# Altium schematic sheet MCU.SchDoc
size 420 x 297 mm; SheetNumber: 4; SheetTotal: 4
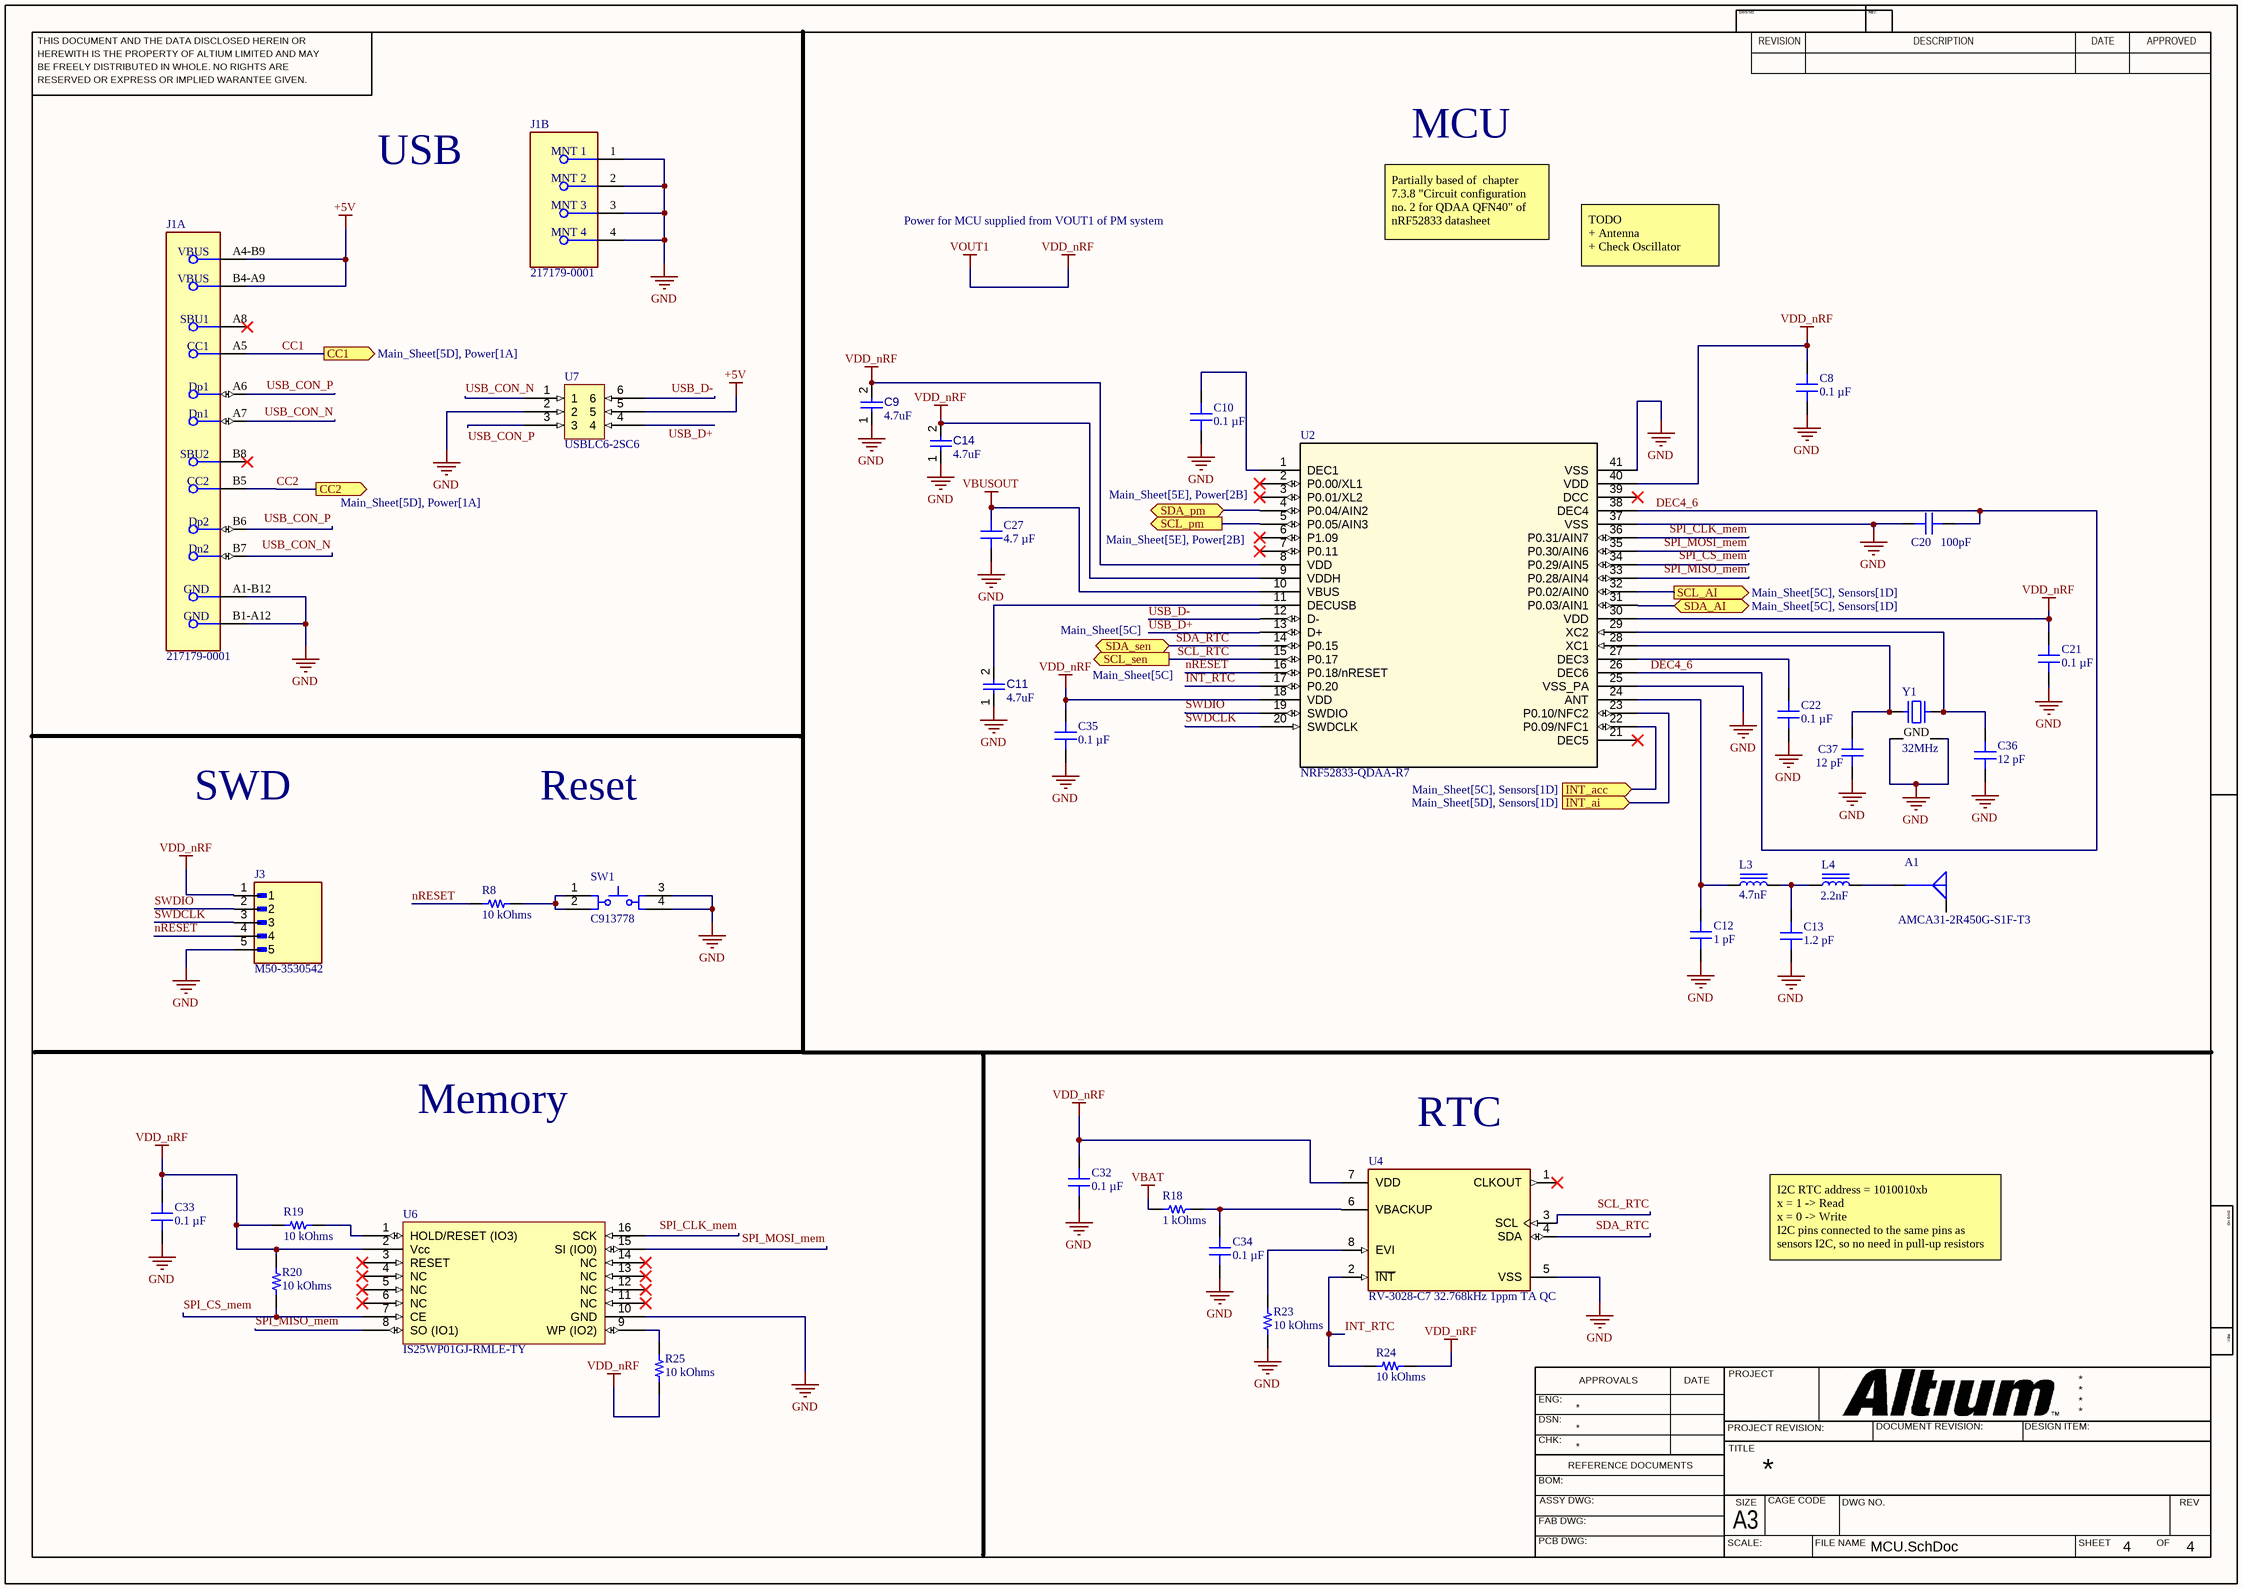
[diagram p0: MCU.SchDoc]

## Parts
A1  AMCA31-2R450G-S1F-T3  [ABRACON AMCA31-2R450G-S1F-T3]
C8  0.1 µF  [CAP 0402_1005]
C9  value 4.7uF  [CAPC0603(1608)100_L]  (hidden comment: Capacitor 1µF +/-40% 50V 0603)
C10  0.1 µF  [CAP 0402_1005]
C11  value 4.7uF  [CAPC0603(1608)100_L]  (hidden comment: Capacitor 1µF +/-40% 50V 0603)
C12  1 pF  [CAP 0201_0603]
C13  1.2 pF  [MURATA GJM033 0201_0603]
C14  value 4.7uF  [CAPC0603(1608)100_L]  (hidden comment: Capacitor 1µF +/-40% 50V 0603)
C20  100pF  [CAP 0402_1005]
C21  0.1 µF  [CAP 0402_1005]
C22  0.1 µF  [CAP 0402_1005]
C27  4.7 µF  [MURATA GRM188 0603_1608]
C32  0.1 µF  [CAP 0402_1005]
C33  0.1 µF  [CAP 0402_1005]
C34  0.1 µF  [CAP 0402_1005]
C35  0.1 µF  [CAP 0402_1005]
C36  12 pF  [CAP 0402_1005]
C37  12 pF  [CAP 0402_1005]
J1  217179-0001  [FP-2171790001-MFG]  (parts A,B of 2)
J3  M50-3530542  [HARWIN_M50-3530542]
L3  4.7nF  [Murata LQW15 0402]
L4  2.2nF  [Murata LQW15 0402]
R8  10 kOhms  [RES 0402_1005]
R18  1 kOhms  [YAGEO RES 0402_1005]
R19  10 kOhms  [RES 0402_1005]
R20  10 kOhms  [RES 0402_1005]
R23  10 kOhms  [RES 0402_1005]
R24  10 kOhms  [RES 0402_1005]
R25  10 kOhms  [RES 0402_1005]
SW1  C913778  [ESWI-TL3342F160QG_V]
U2  NRF52833-QDAA-R7  [QFN40_5X5_DQ_NOR]
U4  RV-3028-C7 32.768kHz 1ppm TA QC  [FP-RV-3028-C7_32_768kHz_1-MFG]
U6  IS25WP01GJ-RMLE-TY  [SOIC127P1030X265-16N]
U7  USBLC6-2SC6  [STM-SOT23-6L_V]
Y1  32MHz  [ABRACON ABM10]

## Ports
CC1 (out, see Main_Sheet[5D], Power[1A]), CC2 (out, see Main_Sheet[5D], Power[1A]), INT_acc (in, see Main_Sheet[5C], Sensors[1D]), INT_ai (in, see Main_Sheet[5D], Sensors[1D]), SCL_AI (out, see Main_Sheet[5C], Sensors[1D]), SCL_pm (out, see Main_Sheet[5E], Power[2B]), SCL_sen (out, see Main_Sheet[5C]), SDA_AI (bidir, see Main_Sheet[5C], Sensors[1D]), SDA_pm (bidir, see Main_Sheet[5E], Power[2B]), SDA_sen (bidir, see Main_Sheet[5C])

## Nets
+5V: J1.A4-B9(VBUS) J1.B4-A9(VBUS) U7.5
GND: C8.1 C9.1 C10.1 C11.1 C12.1 C13.1 C14.1 C20.1 C21.1 C22.1 C27.1 C32.1 C33.1 C34.1 C35.1 C36.1 C37.1 J1.1(MNT_1) J1.2(MNT_2) J1.3(MNT_3) J1.4(MNT_4) J1.A1-B12(GND) J1.B1-A12(GND) J3.5 R23.1 SW1.3 SW1.4 U2.25(VSS_PA) U2.37(VSS) U2.41(VSS) U4.5(VSS) U6.10(GND) U7.2 Y1.2(GND) Y1.4(GND)
VBAT: R18.1
VBUSOUT: C27.2 U2.10(VBUS)
VDD_nRF: C8.2 C9.2 C14.2 C21.2 C32.2 C33.2 C35.2 J3.1 R19.2 R20.2 R24.1 R25.1 U2.8(VDD) U2.9(VDDH) U2.18(VDD) U2.30(VDD) U2.40(VDD) U4.7(VDD) U6.2(Vcc)  [also labelled VOUT1]
CC1: J1.A5(CC1) ; port CC1
CC2: J1.B5(CC2) ; port CC2
DEC4_6: C20.2 U2.26(DEC6) U2.38(DEC4)
INT_acc: U2.22(P0.09/NFC1) ; port INT_acc
INT_ai: U2.23(P0.10/NFC2) ; port INT_ai
INT_RTC: R24.2 U2.17(P0.20) U4.2(~{INT})
nRESET: J3.4 R8.2 U2.16(P0.18/nRESET)
SCL_AI: U2.32(P0.02/AIN0) ; port SCL_AI
SCL_pm: U2.5(P0.05/AIN3) ; port SCL_pm
SCL_RTC: U2.15(P0.17) U4.3(SCL) ; port SCL_sen
SDA_AI: U2.31(P0.03/AIN1) ; port SDA_AI
SDA_pm: U2.4(P0.04/AIN2) ; port SDA_pm
SDA_RTC: U2.14(P0.15) U4.4(SDA) ; port SDA_sen
SPI_CLK_mem: U2.36(P0.31/AIN7) U6.16(SCK)
SPI_CS_mem: R20.1 U2.34(P0.29/AIN5) U6.7(CE)
SPI_MISO_mem: U2.33(P0.28/AIN4) U6.8(SO_(IO1))
SPI_MOSI_mem: U2.35(P0.30/AIN6) U6.15(SI_(IO0))
SWDCLK: J3.3 U2.20(SWDCLK)
SWDIO: J3.2 U2.19(SWDIO)
USB_CON_N: J1.A7(Dn1) J1.B7(Dn2) U7.1
USB_CON_P: J1.A6(Dp1) J1.B6(Dp2) U7.3
USB_D+: U2.13(D+) U7.4
USB_D-: U2.12(D-) U7.6
NetA1_S: A1.S L4.2
NetC10_2: C10.2 U2.1(DEC1)
NetC11_2: C11.2 U2.11(DECUSB)
NetC12_2: C12.2 L3.1 U2.24(ANT)
NetC13_2: C13.2 L3.2 L4.1
NetC22_2: C22.2 U2.27(DEC3)
NetC34_2: C34.2 R18.2 U4.6(VBACKUP)
NetC36_2: C36.2 U2.29(XC2) Y1.3
NetC37_2: C37.2 U2.28(XC1) Y1.1
NetR8_1: R8.1 SW1.1 SW1.2
NetR19_1: R19.1 U6.1(HOLD/RESET_(IO3))
NetR23_2: R23.2 U4.8(EVI)
NetR25_2: R25.2 U6.9(WP_(IO2))

Not connected (* = marked no-connect by the designer): A1 G; J1 A8(SBU1)* B8(SBU2)*; U2 2(P0.00/XL1)* 3(P0.01/XL2)* 6(P1.09)* 7(P0.11)* 21(DEC5)* 39(DCC)*; U4 1(CLKOUT)*; U6 3(RESET)* 4(NC)* 5(NC)* 6(NC)* 11(NC)* 12(NC)* 13(NC)* 14(NC)*

## Notes on the sheet
- USB
- MCU
- Power for MCU supplied from VOUT1 of PM system
- Partially based of  chapter 7.3.8 "Circuit configuration no. 2 for QDAA QFN40" of nRF52833 datasheet
- TODO
  + Antenna
  + Check Oscillator
- SWD
- Reset
- Memory
- (near U4) RTC
- I2C RTC address = 1010010xb
  x = 1 -> Read
  x = 0 -> Write
  I2C pins connected to the same pins as sensors I2C, so no need in pull-up resistors
- THIS DOCUMENT AND THE DATA DISCLOSED HEREIN OR
- HEREWITH IS THE PROPERTY OF ALTIUM LIMITED AND MAY
- DWG NO:
- REVISION
- REV:
- DESCRIPTION
- DATE
- APPROVED
- BE FREELY DISTRIBUTED IN WHOLE. NO RIGHTS ARE
- RESERVED OR EXPRESS OR IMPLIED WARANTEE GIVEN.
- ENG:
- APPROVALS
- PROJECT
- DSN:
- CHK:
- REFERENCE DOCUMENTS
- PROJECT REVISION:
- TITLE
- DOCUMENT REVISION:
- DESIGN ITEM:
- BOM:
- FAB DWG:
- PCB DWG:
- ASSY DWG:
- SCALE:
- A3
- SIZE
- CAGE CODE
- FILE NAME
- DWG NO.
- SHEET
- OF
- REV

## Library data of the parts
A1 = AMCA31-2R450G-S1F-T3: RF ANT 2.4GHZ CHIP SOLDER SMD; Manufacturer: Abracon LLC; Frequency Group: UHF (2GHz ~ 3GHz); Frequency Range: 2.405GHz ~ 2.495GHz; Gain: 0.5dBi; Number of Bands: 1; Power - Max: 3 W; RF Family/Standard: Bluetooth, WiFi; VSWR: 2; Part Number: AMCA31-2R450G-S1F-T3; Antenna Type: Chip; Applications: Bluetooth, Wi-Fi, WLAN; ComponentLink1Description: Datasheet; ComponentLink1URL: https://abracon.com/chip-antenna/AMCA31-2R450G-S1F-T.pdf; ComponentLink2Description: DigiKey Link; ComponentLink2URL: https://www.digikey.com/en/products/detail/abracon-llc/AMCA31-2R450G-S1F-T3/4494340; Frequency (Center/Band): 2.4GHz; Height (Max): 0.047" (1.20mm); LastUpdated: 7/25/2025 4:53:03 PM; Lifecycle Status: Active; Minimum Order: 1; Mounting Type: Surface Mount; Packaging: TapeAndReel; Part Status: Active; Price: 0.15; Series: AMCA; Supplier 1: DigiKey; Supplier Part Number 1: 535-14095-1-ND; Termination: Solder
C8 C10 C21 C35 = CL05B104KP5VPNC: CAP CER 100NF 10V X7R 0402; manufacturer: Samsung Electro-Mechanics; Temperature Coefficient: X7S; Tolerance: ±10%; Part Number: CL05B104KP5VPNC; Capacitance: 0.1 µF; Applications: Automotive; componentlink1description: Datasheet; componentlink1url: https://mm.digikey.com/Volume0/opasdata/d220001/medias/docus/5458/CL05B104KP5VPNC_Spec.pdf; componentlink2description: DigiKey Link; componentlink2url: https://www.digikey.com/en/products/detail/samsung-electro-mechanics/CL05B104KP5VPNC/20498482; Device Package: 0402 (1005 Metric); lastupdated: 2/9/2024 8:03:17 PM; Lifecycle Status: Active; Minimum Order: 1; Mounting Type: Surface Mount, MLCC; Operating Temperature: -55°C ~ 125°C; Package / Case: 0402 (1005 Metric); packaging: TapeAndReel; partid: 56690; price: 0.01; Ratings: AEC-Q200; series: CL; Size / Dimension: 0.039" L x 0.020" W (1.00mm x 0.50mm); Supplier 1: DigiKey; Supplier Part Number 1: 1276-CL05B104KP5VPNCCT-ND; Thickness (Max): 0.022" (0.55mm); value: 0.1 µF; Voltage - Rated: 10V
C9 C11 C14 = CMP-001-00078-4: Chip Capacitor, 1µF +/-40%, 50V, 0603, Thickness 1 mm; Tolerance: 10%; Case/Package: 0603; Pins: 2; Max Operating Temperature: 85°C; Voltage Rating: 50V; Mounting Technology: SMT; Min Operating Temperature: -55°C
C12 = CL03C010BA3GNNC: CAP CER 1PF 25V C0G/NP0 0201; manufacturer: Samsung Electro-Mechanics; Temperature Coefficient: C0G, NP0; Tolerance: ±5%; Part Number: CL03C010BA3GNNC; Capacitance: 1 pF; Applications: General Purpose; componentlink1description: Datasheet; componentlink1url: http://www.samsungsem.com/kr/support/product-search/mlcc/CL03C010BA3GNNC.jsp; componentlink2description: DigiKey Link; componentlink2url: https://www.digikey.com/en/products/detail/samsung-electro-mechanics/CL03C010BA3GNNC/3887019; Device Package: 0201 (0603 Metric); lastupdated: 6/4/2024 7:01:06 PM; Lifecycle Status: Active; Minimum Order: 1; Mounting Type: Surface Mount, MLCC; Operating Temperature: -55°C ~ 125°C; Package / Case: 0201 (0603 Metric); packaging: TapeAndReel; partid: 1289; Part Status: Active; price: 0.01; series: CL; Size / Dimension: 0.024" L x 0.012" W (0.60mm x 0.30mm); Supplier 1: DigiKey; Supplier Part Number 1: 1276-1361-1-ND; Thickness (Max): 0.013" (0.33mm); value: 1 pF; Voltage - Rated: 25V
C13 = GJM0335C1E1R2BB01D: CAP CER 1.2PF 25V C0G/NP0 0201; manufacturer: Murata Electronics; Temperature Coefficient: C0G, NP0; Tolerance: ±5%; Part Number: GJM0335C1E1R2BB01D; Capacitance: 1.2 pF; Applications: RF, Microwave, High Frequency; componentlink1description: Datasheet; componentlink1url: https://search.murata.co.jp/Ceramy/image/img/A01X/G101/ENG/GJM0335C1E1R2BB01-01.pdf; componentlink2description: DigiKey Link; componentlink2url: https://www.digikey.com/en/products/detail/murata-electronics/GJM0335C1E1R2BB01D/2592512; Device Package: 0201 (0603 Metric); Features: High Q, Low Loss; lastupdated: 7/20/2024 12:14:17 AM; Lifecycle Status: Active; Minimum Order: 1; Mounting Type: Surface Mount; Operating Temperature: -55°C ~ 125°C; Package / Case: 0201 (0603 Metric); packaging: TapeAndReel; partid: 205; Part Status: Active; price: 0.01; series: GJM; Size / Dimension: 0.024" L x 0.012" W (0.60mm x 0.30mm); Supplier 1: DigiKey; Supplier Part Number 1: 490-11173-1-ND; Thickness (Max): 0.013" (0.33mm); value: 1.2 pF; Voltage - Rated: 25V
C20 = 04023A101FAT2A: CAP CER 100PF 25V NP0 0402; manufacturer: AVX Corporation; Temperature Coefficient: C0G, NP0; Tolerance: ±1%; Part Number: 04023A101FAT2A; Capacitance: 100pF; Applications: General Purpose; componentlink1description: Datasheet; componentlink1url: http://datasheets.avx.com/C0GNP0-Dielectric.pdf; componentlink2description: DigiKey Link; componentlink2url: http://digikey.com/product-detail/en/avx-corporation/04023A101FAT2A/478-12607-1-ND/9949145; Device Package: 0402 (1005 Metric); lastupdated: 2/8/2022 12:26:58 PM; Lifecycle Status: Active; Minimum Order: 1; Mounting Type: Surface Mount, MLCC; Operating Temperature: -55°C ~ 125°C; Package / Case: 0402 (1005 Metric); packaging: TapeAndReel; partid: 1996; Part Status: Active; price: 0.11; series: -; Size / Dimension: 0.039" L x 0.020" W (1.00mm x 0.50mm); Supplier 1: DigiKey; Supplier Part Number 1: 478-12607-1-ND; Thickness (Max): 0.022" (0.56mm); value: 100pF; Voltage - Rated: 25V
C22 C32-C34 = CL05B104KP5VPNC: CAP CER 100NF 10V X7R 0402; manufacturer: Samsung Electro-Mechanics; Tolerance: ±10%; Part Number: CL05B104KP5VPNC; Capacitance: 0.1 µF; Applications: Automotive; componentlink1description: Datasheet; componentlink1url: https://mm.digikey.com/Volume0/opasdata/d220001/medias/docus/5458/CL05B104KP5VPNC_Spec.pdf; componentlink2description: DigiKey Link; componentlink2url: https://www.digikey.com/en/products/detail/samsung-electro-mechanics/CL05B104KP5VPNC/20498482; Device Package: 0402 (1005 Metric); lastupdated: 2/9/2024 8:03:17 PM; Lifecycle Status: Active; Minimum Order: 1; Mounting Type: Surface Mount, MLCC; Operating Temperature: -55°C ~ 125°C; Package / Case: 0402 (1005 Metric); packaging: TapeAndReel; partid: 56690; price: 0.01; Ratings: AEC-Q200; series: CL; Size / Dimension: 0.039" L x 0.020" W (1.00mm x 0.50mm); Supplier 1: DigiKey; Supplier Part Number 1: 1276-CL05B104KP5VPNCCT-ND; Temperature Coefficient: X7R; Thickness (Max): 0.022" (0.55mm); value: 0.1 µF; Voltage - Rated: 10V
C27 = GRM188C71A475KE11D: CAP CER 4.7UF 10V X7S 0603; manufacturer: Murata Electronics; Tolerance: ±10%; Part Number: GRM188C71A475KE11D; Capacitance: 4.7 µF; Applications: General Purpose; componentlink1description: Datasheet; componentlink1url: https://search.murata.co.jp/Ceramy/image/img/A01X/G101/ENG/GRM188C71A475KE11-01.pdf; componentlink2description: DigiKey Link; componentlink2url: https://www.digikey.com/en/products/detail/murata-electronics/GRM188C71A475KE11D/4905309; Device Package: 0603 (1608 Metric); lastupdated: 7/20/2024 12:23:22 AM; Lifecycle Status: Active; Minimum Order: 1; Mounting Type: Surface Mount, MLCC; Operating Temperature: -55°C ~ 125°C; Package / Case: 0603 (1608 Metric); packaging: TapeAndReel; partid: 2397; Part Status: Active; price: 0.03; series: GRM; Size / Dimension: 0.063" L x 0.031" W (1.60mm x 0.80mm); Supplier 1: DigiKey; Supplier Part Number 1: 490-11992-1-ND; Temperature Coefficient: X7S; Thickness (Max): 0.037" (0.95mm); value: 4.7 µF; Voltage - Rated: 10V
C36 C37 = CBR04C120F5GAC: CAP CER 12PF 50V C0G/NP0 0402; manufacturer: KEMET; Temperature Coefficient: C0G, NP0; Tolerance: ±1%; Part Number: CBR04C120F5GAC; Capacitance: 12 pF; Applications: RF, Microwave, High Frequency; componentlink1description: Datasheet; componentlink1url: https://api.kemet.com/component-edge/download/datasheet/CBR04C120F5GAC.pdf; componentlink2description: DigiKey Link; componentlink2url: https://www.digikey.com/en/products/detail/kemet/CBR04C120F5GAC/3479654; Device Package: 0402 (1005 Metric); Features: High Q, Low Loss, Ultra Low ESR; lastupdated: 2/9/2024 8:04:38 PM; Lifecycle Status: Active; Minimum Order: 1; Mounting Type: Surface Mount, MLCC; Operating Temperature: -55°C ~ 125°C; Package / Case: 0402 (1005 Metric); packaging: TapeAndReel; partid: 1750; Part Status: Active; price: 0.06; series: CBR-SMD RF C0G; Size / Dimension: 0.039" L x 0.020" W (1.00mm x 0.50mm); Supplier 1: DigiKey; Supplier Part Number 1: 399-8815-1-ND; Thickness (Max): 0.022" (0.55mm); value: 12 pF; Voltage - Rated: 50V
J1 = CMP-04767-000028-2: CONN RCP USB2.0 TYP C 24P SMD RA; NexarPartId: 117190526; Gender: Receptacle; Number of Contacts: 16; Current Rating: 1.25A; Voltage Rating: 30V; Min Operating Temperature: -40°C; USB Standard: USB 2.0; Height: 3.36mm; Contact Material: Gold, Nickel; Max Operating Temperature: 85°C
J3 = CMP-002-00071-1: 1.27mm (0.05) Pitch SIL Vertical Throughboard Pin Header, selective gold + tin, 5 contacts; MF: Harwin; Value: *; Component Type: Standard; Pins: 5; Design Item ID: M50-3530542; Case/Package: None; Source: M50-3530542.SchLib; SnapEDA_Link: https://www.snapeda.com/parts/M50-3530542/Harwin/view-part/?ref=snap; MP: M50-3530542; Check_prices: https://www.snapeda.com/parts/M50-3530542/Harwin/view-part/?ref=eda
L3 L4 = LQW15CN2R2M10D: FIXED IND 2.2UH 170MA 1.8OHM SMD; Manufacturer: Murata Electronics; DC Resistance (DCR): 1.8Ohm Max; Frequency - Self Resonant: 100MHz; Inductance: 2.2 µH; Inductance Frequency - Test: 100 MHz; Material - Core: Ferrite; Shielding: Unshielded; Tolerance: ±5%; Type: Drum Core, Wirewound; Value: 2.2 µH; Part Number: LQW15CN2R2M10D; ComponentLink1Description: Datasheet; ComponentLink1URL: https://search.murata.co.jp/Ceramy/image/img/P02/JELF243A-0096.pdf; ComponentLink2Description: DigiKey Link; ComponentLink2URL: https://www.digikey.com/en/products/detail/murata-electronics/LQW15CN2R2M10D/6799054; Current Rating (Amps): 170 mA; Device Package: 0402 (1005 Metric); Height - Seated (Max): 0.024" (0.60mm); LastUpdated: 7/19/2024 11:52:51 PM; Lifecycle Status: Active; Minimum Order: 1; Mounting Type: Surface Mount; Operating Temperature: -55°C ~ 125°C; Package / Case: 0402 (1005 Metric); Packaging: TapeAndReel; PartId: 420; Part Status: Active; Price: 0.17; Series: LQW15; Size / Dimension: 0.039" L x 0.024" W (1.00mm x 0.60mm); Supplier 1: DigiKey; Supplier Part Number 1: 490-15629-1-ND
R8 R19 R20 R23-R25 = RP73PF1E10KBTD: RES 10K OHM 0.1% 1/10W 0402; Manufacturer: TE Connectivity Passive Product; Power (Watts): 0.1W, 1/10W; Temperature Coefficient: ±25ppm/°C; Tolerance: ±1%; Part Number: RP73PF1E10KBTD; Value: 10 kOhms; ComponentLink1Description: Datasheet; ComponentLink1URL: https://www.te.com/commerce/DocumentDelivery/DDEController?Action=srchrtrv&DocNm=1773272&DocType=DS&DocLang=English; ComponentLink2Description: DigiKey Link; ComponentLink2URL: https://www.digikey.com/en/products/detail/te-connectivity-passive-product/RP73PF1E10KBTD/8260957; Composition: Thin Film; Device Package: 0402 (1005 Metric); Height - Seated (Max): 0.014" (0.35mm); LastUpdated: 2/9/2024 8:30:24 PM; Lifecycle Status: Active; Minimum Order: 1; Number of Terminations: 2; Operating Temperature: -55°C ~ 155°C; Package / Case: 0402 (1005 Metric); Packaging: TapeAndReel; PartId: 2434; Part Status: Active; Price: 0.08; Resistance: 10 kOhms; Series: RP73, Holsworthy; Size / Dimension: 0.039" L x 0.020" W (1.00mm x 0.50mm); Supplier 1: DigiKey; Supplier Part Number 1: A127415CT-ND; Supplier Device Package: 0402
R18 = AC0402JR-071KL: RES SMD 1K OHM 5% 1/16W 0402; Manufacturer: Yageo; Power (Watts): 0.063W, 1/16W; Temperature Coefficient: ±100ppm/°C; Part Number: AC0402JR-071KL; Value: 1 kOhms; ComponentLink1Description: Datasheet; ComponentLink1URL: https://www.yageo.com/upload/media/product/productsearch/datasheet/rchip/PYu-AC_51_RoHS_L_7.pdf; ComponentLink2Description: DigiKey Link; ComponentLink2URL: https://www.digikey.com/en/products/detail/yageo/AC0402JR-071KL/5895603; Composition: Thick Film; Device Package: 0402 (1005 Metric); Features: Automotive AEC-Q200, Moisture Resistant; Height - Seated (Max): 0.015" (0.37mm); LastUpdated: 8/31/2025 3:04:17 PM; Lifecycle Status: Active; Minimum Order: 1; Number of Terminations: 2; Operating Temperature: -55°C ~ 155°C; Package / Case: 0402 (1005 Metric); Packaging: CutTape; PartId: 3403; Part Status: Active; Price: 0.01; Ratings: AEC-Q200; Resistance: 1 kOhms; Series: AC; Size / Dimension: 0.039" L x 0.020" W (1.00mm x 0.50mm); Supplier 1: DigiKey; Supplier Part Number 1: YAG3525CT-ND; Supplier Device Package: 0402; Tolerance: ±5%
SW1 = CMP-011-00008-2: Tactile Switch, SPST-NO, 50 mA, 12 V, 4-Pin SMD, RoHS, Tape and Reel; Manufacturer: E-Switch; Operating Force: 1.6N; Current Rating: 50mA; Throw Configuration: SPST; Max Voltage Rating (DC): 12V; Datasheet URL: http://spec_sheets.e-switch.com/specs/P010632.pdf; Manufacturer URL: http://www.e-switch.ch/en/; Mounting Technology: SM; Case/Package: TL3342F160QG; Package Quantity: 3000; Contact Material: Silver; Package Description: 4-Pin Surface Mount Device, Body 5 x 5 mm, Pitch 6.3 mm; Package Reference: TL3342F160QG; Datasheet Version: Rev. I, 12/2010; Voltage Rating (DC): 12V; Contact Plating: Silver; RoHS Compliant: True; Packaging: TapeandReel
U2 = CMP-003-000000-1: Description; Manufacturer_Name: Nordic Semiconductor; Copyright: Copyright (C) 2025 Ultra Librarian. All rights reserved.; Type: Type; Source: NRF52833-QDAA-R7.SchLib; Manufacturer_Part_Number: NRF52833-QDAA-R7; RefDes: RefDes; Design Item ID: NRF52833-QDAA-R7
U4 = CMP-226158-000001-1: Real Time Clock Serial 2byte Clock/Calendar/Alarm/Timer/Battery Backup 8-Pin CSMD T/R; Manufacturer: Micro Crystal; Memory Size: 2Bytes; Number Of Outputs: 1; Nominal Supply Current: 0.04uA; Interface: I2C; Max Supply Voltage: 5.5V; Min Supply Voltage: 1.1V; Package: RV-3028-C7 32.768kHz 1ppm TA QC; Lead Free: Yes; RoHS: TRUE; Device Class L1: Integrated Circuits (ICs); Temperature: -40°C to +85°C; ComponentLink2Description: Datasheet; Height: 0.8mm; Octopart: https://octopart.com/rv-3028-c7+32.768khz+1ppm+ta+qc-micro+crystal-98880451; ComponentLink2URL: https://www.microcrystal.com/fileadmin/Media/Products/RTC/Datasheet/RV-3028-C7.pdf; Device Class L2: Clock and Timing; Temperature Range Low: -40°C; Temperature Range High: +85°C; Automotive: No; Device Class L3: Real Time Clocks; Manufacturer Part Number: RV-3028-C7 32.768kHz 1ppm TA QC; Frequency: 32.768kHz; Ambient Temperature Range High: +85°C; Ambient Temperature Range Low: -40°C; Category: IC; Mouser Description: RV-3028-C7 32.768KHZ 1PPM Ta Qc
U6 = CMP-019-00050-1: Flash Memory, Serial NOR, 1 Gbit, 128M x 8bit, QPI, SPI, SOIC, 16 Pins
U7 = CMP-015-00011-1: 5A 17V 6V Unidirectional 5.25V SOT-23-6 ESD and Surge Protection (TVS/ESD) ROHS; Case/Package: SOT-23; Pins: 6; Max Operating Temperature: 125°C; Min Operating Temperature: -40°C; Mounting Technology: Surface Mount
Y1 = ABM10-32.000MHZ-8-7-A15-T: CRYSTAL 32.0000MHZ 8PF SMD; Manufacturer: Abracon LLC; ESR (Equivalent Series Resistance): 70 Ohms; Frequency Stability: ±15ppm; Operating Mode: Fundamental; Part Number: ABM10-32.000MHZ-8-7-A15-T; ComponentLink1Description: Datasheet; ComponentLink1URL: https://abracon.com/Resonators/ABM10.pdf; ComponentLink2Description: DigiKey Link; ComponentLink2URL: http://digikey.com/product-detail/en/abracon-llc/ABM10-32.000MHZ-8-7-A15-T/535-9625-1-ND/1237092; Device Package: 4-SMD, No Lead; Frequency: 32MHz; Frequency Tolerance: ±15ppm; Height - Seated (Max): 0.028" (0.70mm); LastUpdated: 3/19/2020 10:27:46 PM; Lifecycle Status: Active; Load Capacitance: 8pF; Minimum Order: 1; Mounting Type: Surface Mount; Operating Temperature: -10°C ~ 60°C; Package / Case: 4-SMD, No Lead; Packaging: TapeAndReel; PartId: 263; Part Status: Active; Price: 0.60; Series: ABM10; Size / Dimension: 0.098" L x 0.079" W (2.50mm x 2.00mm); Supplier 1: DigiKey; Supplier Part Number 1: 535-9625-1-ND; Type: MHz Crystal; Value: 32MHz